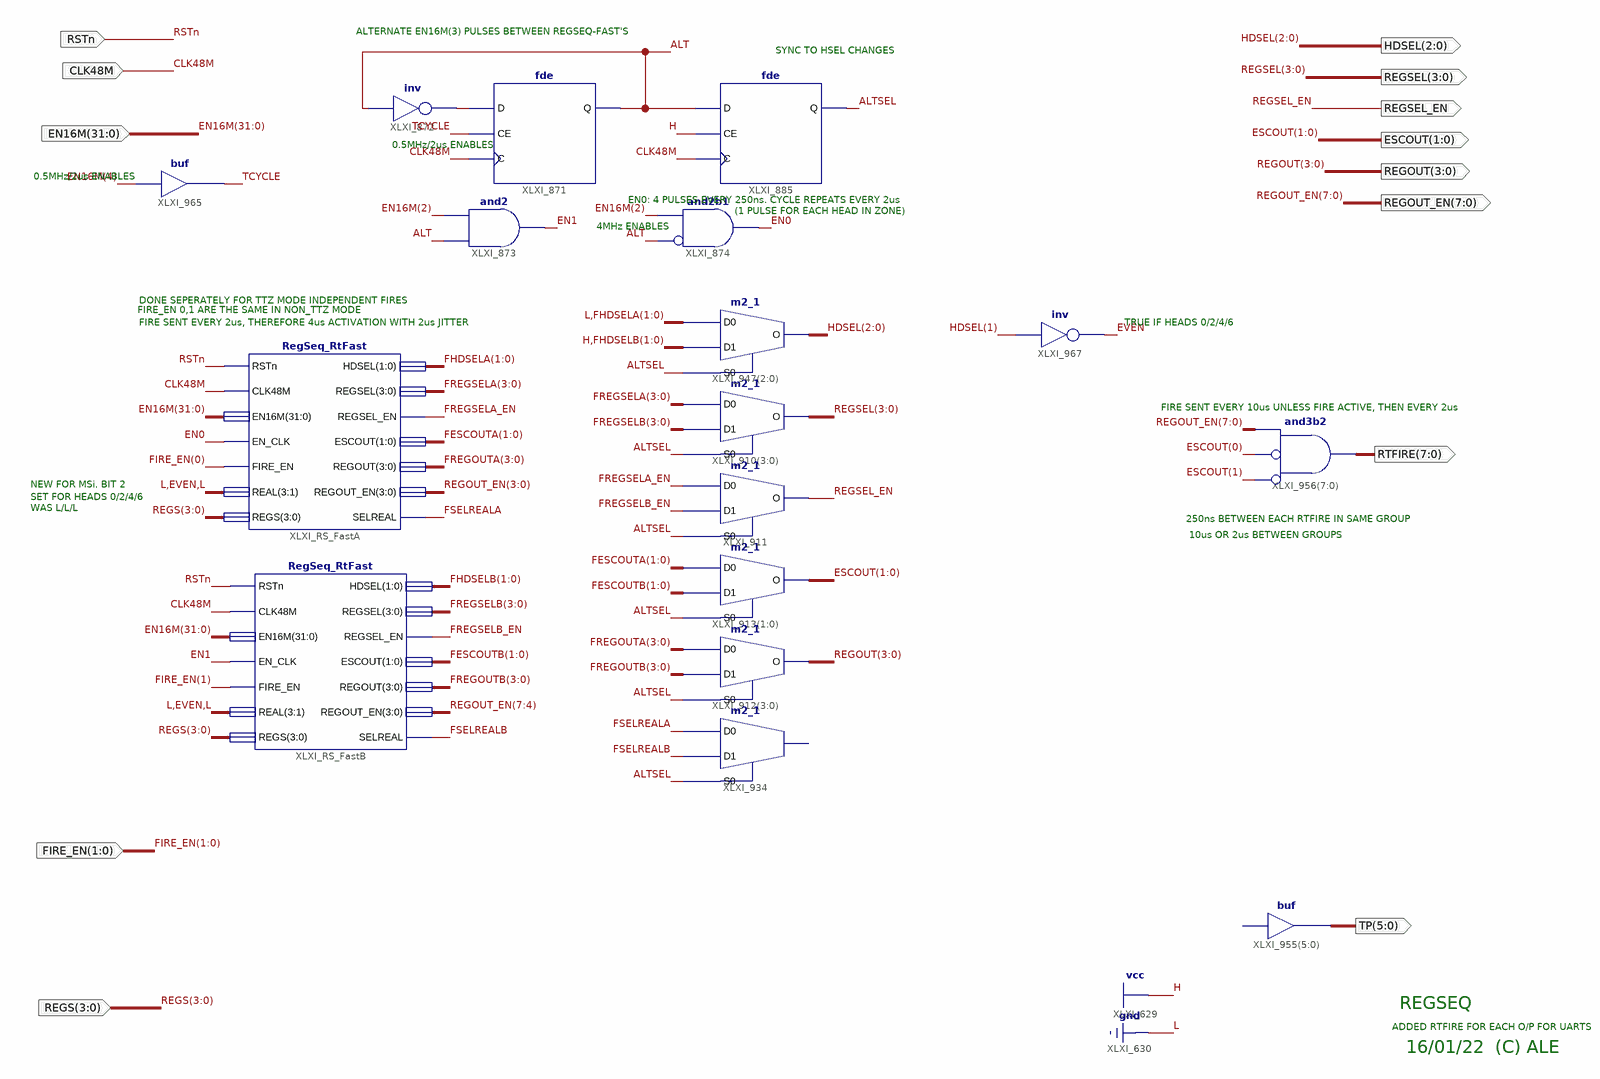
[diagram p0: schematic sheet 1]
// Xilinx ISE schematic RegSeq.sch (spartan6) as structural Verilog: 17 symbols, 13 ports
module RegSeq (
  input  [3:0] REGS,
  input  CLK48M,
  input  RSTn,
  input  [31:0] EN16M,
  input  [1:0] FIRE_EN,
  output [5:0] TP,
  output [2:0] HDSEL,
  output [3:0] REGSEL,
  output REGSEL_EN,
  output [1:0] ESCOUT,
  output [3:0] REGOUT,
  output [7:0] REGOUT_EN,
  output [7:0] RTFIRE
);

  wire ALT, ALTSEL, EN0, EN1, EVEN, FREGSELA_EN, FREGSELB_EN, FSELREALA, FSELREALB, TCYCLE, XLXN_79;
  wire [1:0] FESCOUTA, FESCOUTB, FHDSELA, FHDSELB;
  wire [3:0] FREGOUTA, FREGOUTB, FREGSELA, FREGSELB;

  fde XLXI_871 (.C(CLK48M), .CE(TCYCLE), .D(XLXN_79), .Q(ALT));
  not XLXI_872 (XLXN_79, ALT);
  fde XLXI_885 (.C(CLK48M), .CE(1'b1), .D(ALT), .Q(ALTSEL));
  and XLXI_873 (EN1, ALT, EN16M[2]);
  and XLXI_874 (EN0, ~ALT, EN16M[2]);  // and2b1
  m2_1 XLXI_910[3:0] (.D0(FREGSELA), .D1(FREGSELB), .S0(ALTSEL), .O(REGSEL));
  m2_1 XLXI_913[1:0] (.D0(FESCOUTA), .D1(FESCOUTB), .S0(ALTSEL), .O(ESCOUT));
  m2_1 XLXI_912[3:0] (.D0(FREGOUTA), .D1(FREGOUTB), .S0(ALTSEL), .O(REGOUT));
  m2_1 XLXI_911 (.D0(FREGSELA_EN), .D1(FREGSELB_EN), .S0(ALTSEL), .O(REGSEL_EN));
  m2_1 XLXI_934 (.D0(FSELREALA), .D1(FSELREALB), .S0(ALTSEL));  // open: O
  RegSeq_RtFast XLXI_RS_FastB (
    .CLK48M(CLK48M), .EN16M(EN16M), .EN_CLK(EN1), .ESCOUT(FESCOUTB), .FIRE_EN(FIRE_EN[1]), .HDSEL(FHDSELB),
    .REAL({1'b0, EVEN, 1'b0}), .REGOUT(FREGOUTB), .REGOUT_EN(REGOUT_EN[7:4]), .REGS(REGS), .REGSEL(FREGSELB),
    .REGSEL_EN(FREGSELB_EN), .RSTn(RSTn), .SELREAL(FSELREALB));
  RegSeq_RtFast XLXI_RS_FastA (
    .CLK48M(CLK48M), .EN16M(EN16M), .EN_CLK(EN0), .ESCOUT(FESCOUTA), .FIRE_EN(FIRE_EN[0]), .HDSEL(FHDSELA),
    .REAL({1'b0, EVEN, 1'b0}), .REGOUT(FREGOUTA), .REGOUT_EN(REGOUT_EN[3:0]), .REGS(REGS), .REGSEL(FREGSELA),
    .REGSEL_EN(FREGSELA_EN), .RSTn(RSTn), .SELREAL(FSELREALA));
  m2_1 XLXI_947[2:0] (.D0({1'b0, FHDSELA}), .D1({1'b1, FHDSELB}), .S0(ALTSEL), .O(HDSEL));
  // buf XLXI_955[5..0] has open pins: I=open, O=TP
  assign RTFIRE = ~{8{ESCOUT[1]}} & ~{8{ESCOUT[0]}} & REGOUT_EN;  // and3b2 XLXI_956[7..0], 8 bits wide
  buf XLXI_965 (TCYCLE, EN16M[4]);
  not XLXI_967 (EVEN, HDSEL[1]);

  // Notes on the sheet:
  //   ALTERNATE EN16M(3) PULSES BETWEEN REGSEQ-FAST'S
  //   SYNC TO HSEL CHANGES
  //   0.5MHz/2us ENABLES
  //   0.5MHz/2us ENABLES
  //   EN0: 4 PULSES EVERY 250ns. CYCLE REPEATS EVERY 2us
  //   (1 PULSE FOR EACH HEAD IN ZONE)
  //   4MHz ENABLES
  //   DONE SEPERATELY FOR TTZ MODE INDEPENDENT FIRES
  //   FIRE_EN 0,1 ARE THE SAME IN NON_TTZ MODE
  //   FIRE SENT EVERY 2us, THEREFORE 4us ACTIVATION WITH 2us JITTER
  //   TRUE IF HEADS 0/2/4/6
  //   FIRE SENT EVERY 10us UNLESS FIRE ACTIVE, THEN EVERY 2us
  //   NEW FOR MSi. BIT 2
  //   SET FOR HEADS 0/2/4/6
  //   WAS L/L/L
  //   250ns BETWEEN EACH RTFIRE IN SAME GROUP
  //   10us OR 2us BETWEEN GROUPS
  //   REGSEQ
  //   ADDED RTFIRE FOR EACH O/P FOR UARTS
  //   16/01/22  (C) ALE
endmodule
